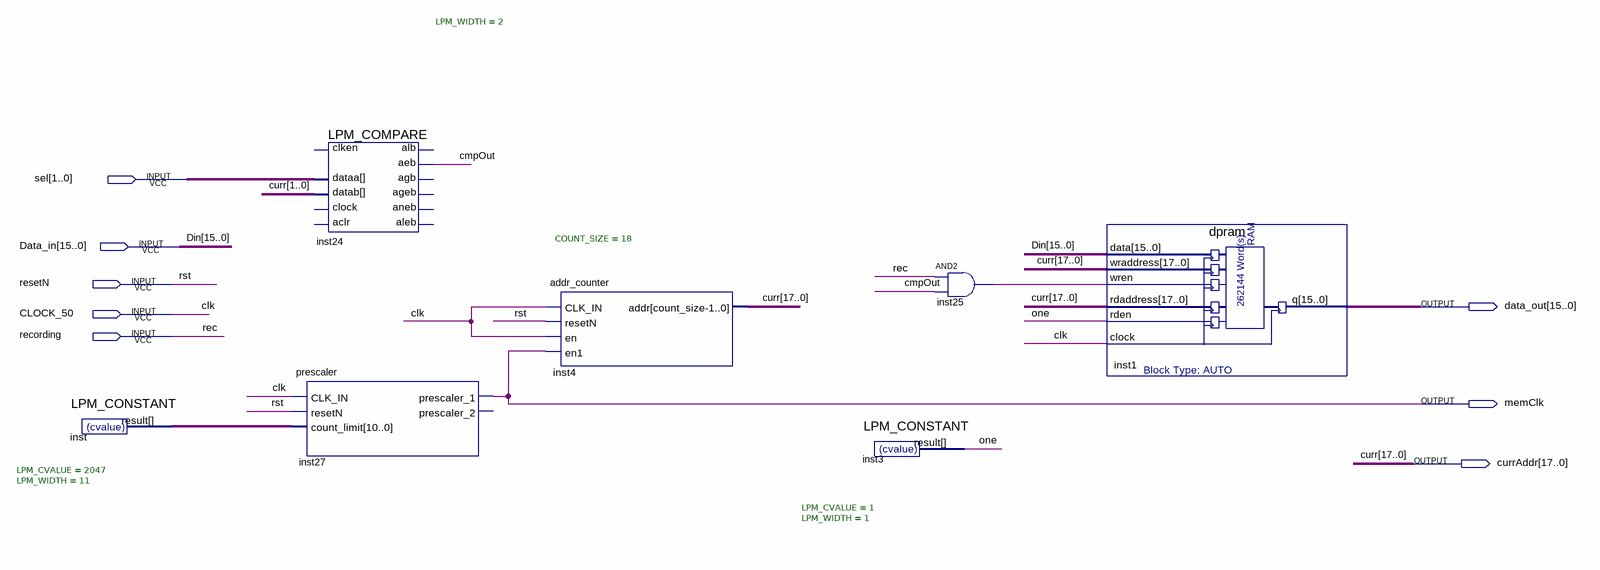
[diagram p0: schematic sheet]
// Quartus schematic recorder_module_looper.bdf as structural Verilog: 7 symbols, 8 pins
module recorder_module_looper (
  input  [1:0] sel,
  input  [15:0] Data_in,
  input  resetN,
  input  CLOCK_50,
  input  recording,
  output [15:0] data_out,
  output memClk,
  output [17:0] currAddr
);

  wire cmpOut, inst25_out, one;
  wire [10:0] inst_result;

  LPM_CONSTANT #(.LPM_CVALUE(2047), .LPM_WIDTH(11)) inst (.result(inst_result));
  LPM_COMPARE #(.LPM_WIDTH(2)) inst24 (
    .dataa(sel), .datab(currAddr[1:0]), .aeb(cmpOut));  // open: clock, aclr, clken, aleb, agb, aneb, ageb, alb
  prescaler inst27 (
    .CLK_IN(CLOCK_50), .resetN(resetN), .count_limit(inst_result), .prescaler_1(memClk));  // open: prescaler_2
  addr_counter #(.COUNT_SIZE(18)) inst4 (
    .CLK_IN(CLOCK_50), .resetN(resetN), .en(CLOCK_50), .en1(memClk), .addr(currAddr));
  LPM_CONSTANT #(.LPM_CVALUE(1), .LPM_WIDTH(1)) inst3 (.result(one));
  and inst25 (inst25_out, recording, cmpOut);
  dpram inst1 (
    .data(Data_in), .wraddress(currAddr), .wren(inst25_out), .rdaddress(currAddr), .rden(one),
    .clock(CLOCK_50), .q(data_out));

  // Other names for the same wires on the sheet: clk = CLOCK_50; curr[17:0] = currAddr; Din[15:0] = Data_in;
  //   rec = recording; rst = resetN
endmodule
